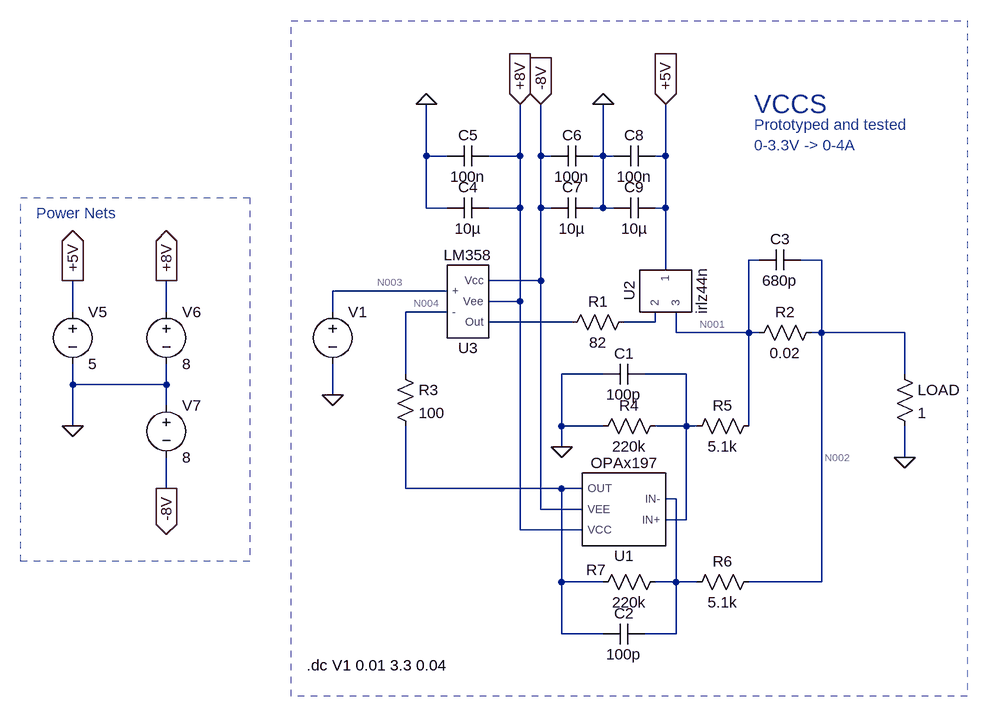
[diagram p0: schematic VCCS V2.asc]
VCCS V2.asc, the LTspice schematic file:
Version 4.1
SHEET 1 1476 900
WIRE 288 64 288 -16
WIRE 320 64 288 64
WIRE 432 64 432 -16
WIRE 432 64 384 64
WIRE 464 64 464 -16
WIRE 480 64 464 64
WIRE 560 64 560 -16
WIRE 560 64 544 64
WIRE 576 64 560 64
WIRE 656 64 656 -16
WIRE 656 64 640 64
WIRE 288 144 288 64
WIRE 320 144 288 144
WIRE 432 144 432 64
WIRE 432 144 384 144
WIRE 464 144 464 64
WIRE 480 144 464 144
WIRE 560 144 560 64
WIRE 560 144 544 144
WIRE 576 144 560 144
WIRE 656 144 656 64
WIRE 656 144 640 144
WIRE 800 224 784 224
WIRE 896 224 864 224
WIRE 656 240 656 144
WIRE 464 256 464 144
WIRE 464 256 384 256
WIRE 320 272 144 272
WIRE 432 288 432 144
WIRE 432 288 384 288
WIRE -256 304 -256 256
WIRE -112 304 -112 256
WIRE 144 304 144 272
WIRE 320 304 256 304
WIRE 512 320 384 320
WIRE 640 320 640 304
WIRE 640 320 592 320
WIRE 672 336 672 304
WIRE 784 336 784 224
WIRE 784 336 672 336
WIRE 800 336 784 336
WIRE 896 336 896 224
WIRE 896 336 880 336
WIRE 1024 336 896 336
WIRE 256 400 256 304
WIRE 560 400 496 400
WIRE 688 400 624 400
WIRE 1024 400 1024 336
WIRE -256 416 -256 384
WIRE -112 416 -112 384
WIRE -112 416 -256 416
WIRE 144 432 144 384
WIRE -112 448 -112 416
WIRE -256 480 -256 416
WIRE 496 480 496 400
WIRE 560 480 496 480
WIRE 688 480 688 400
WIRE 688 480 640 480
WIRE 704 480 688 480
WIRE 784 480 784 336
WIRE 496 512 496 480
WIRE 1024 528 1024 480
WIRE -112 576 -112 528
WIRE 256 576 256 480
WIRE 496 576 256 576
WIRE 528 576 496 576
WIRE 672 592 656 592
WIRE 464 608 464 256
WIRE 528 608 464 608
WIRE 688 624 688 480
WIRE 688 624 656 624
WIRE 432 640 432 288
WIRE 528 640 432 640
WIRE 496 720 496 576
WIRE 560 720 496 720
WIRE 672 720 672 592
WIRE 672 720 640 720
WIRE 704 720 672 720
WIRE 896 720 896 336
WIRE 896 720 784 720
WIRE 496 800 496 720
WIRE 560 800 496 800
WIRE 672 800 672 720
WIRE 672 800 624 800
FLAG 1024 528 0
FLAG 496 512 0
FLAG 144 432 0
FLAG -256 480 0
FLAG -256 256 +5V
IOPIN -256 256 Out
FLAG 656 -16 +5V
IOPIN 656 -16 In
FLAG -112 256 +8V
IOPIN -112 256 Out
FLAG -112 576 -8V
IOPIN -112 576 Out
FLAG 432 -16 +8V
IOPIN 432 -16 In
FLAG 464 -16 -8V
IOPIN 464 -16 In
FLAG 560 -16 0
FLAG 288 -16 0
SYMBOL res 896 320 R90
WINDOW 0 0 56 VBottom 2
WINDOW 3 32 56 VTop 2
SYMATTR InstName R2
SYMATTR Value 0.02
SYMBOL res 1008 384 R0
SYMATTR InstName LOAD
SYMATTR Value 1
SYMBOL res 656 464 R90
WINDOW 0 0 56 VBottom 2
WINDOW 3 32 56 VTop 2
SYMATTR InstName R4
SYMATTR Value 220k
SYMBOL res 800 464 R90
WINDOW 0 0 56 VBottom 2
WINDOW 3 32 56 VTop 2
SYMATTR InstName R5
SYMATTR Value 5.1k
SYMBOL res 800 704 R90
WINDOW 0 0 56 VBottom 2
WINDOW 3 32 56 VTop 2
SYMATTR InstName R6
SYMATTR Value 5.1k
SYMBOL res 656 704 R90
WINDOW 0 13 107 VBottom 2
WINDOW 3 32 56 VTop 2
SYMATTR InstName R7
SYMATTR Value 220k
SYMBOL voltage 144 288 R0
WINDOW 123 0 0 Left 0
WINDOW 39 0 0 Left 0
SYMATTR InstName V1
SYMATTR Value ""
SYMBOL voltage -256 288 R0
WINDOW 123 0 0 Left 0
WINDOW 39 0 0 Left 0
SYMATTR InstName V5
SYMATTR Value 5
SYMBOL voltage -112 288 R0
WINDOW 123 0 0 Left 0
WINDOW 39 0 0 Left 0
SYMATTR InstName V6
SYMATTR Value 8
SYMBOL voltage -112 432 R0
WINDOW 123 0 0 Left 0
WINDOW 39 0 0 Left 0
SYMATTR InstName V7
SYMATTR Value 8
SYMBOL irlz44n 656 272 M90
SYMATTR InstName U2
SYMBOL OPAx197 592 608 R180
SYMATTR InstName U1
SYMBOL res 608 304 R90
WINDOW 0 0 56 VBottom 2
WINDOW 3 32 56 VTop 2
SYMATTR InstName R1
SYMATTR Value 82
SYMBOL cap 624 384 R90
WINDOW 0 0 32 VBottom 2
WINDOW 3 32 32 VTop 2
SYMATTR InstName C1
SYMATTR Value 100p
SYMBOL cap 624 784 R90
WINDOW 0 0 32 VBottom 2
WINDOW 3 32 32 VTop 2
SYMATTR InstName C2
SYMATTR Value 100p
SYMBOL cap 864 208 R90
WINDOW 0 0 32 VBottom 2
WINDOW 3 32 32 VTop 2
SYMATTR InstName C3
SYMATTR Value 680p
SYMBOL cap 384 128 R90
WINDOW 0 0 32 VBottom 2
WINDOW 3 32 32 VTop 2
SYMATTR InstName C4
SYMATTR Value 10µ
SYMBOL cap 384 48 R90
WINDOW 0 0 32 VBottom 2
WINDOW 3 32 32 VTop 2
SYMATTR InstName C5
SYMATTR Value 100n
SYMBOL cap 544 48 R90
WINDOW 0 0 32 VBottom 2
WINDOW 3 32 32 VTop 2
SYMATTR InstName C6
SYMATTR Value 100n
SYMBOL cap 544 128 R90
WINDOW 0 0 32 VBottom 2
WINDOW 3 32 32 VTop 2
SYMATTR InstName C7
SYMATTR Value 10µ
SYMBOL cap 640 48 R90
WINDOW 0 0 32 VBottom 2
WINDOW 3 32 32 VTop 2
SYMATTR InstName C8
SYMATTR Value 100n
SYMBOL cap 640 128 R90
WINDOW 0 0 32 VBottom 2
WINDOW 3 32 32 VTop 2
SYMATTR InstName C9
SYMATTR Value 10µ
SYMBOL res 240 384 R0
SYMATTR InstName R3
SYMATTR Value 100
SYMBOL LM358 352 288 M180
SYMATTR InstName U3
TEXT 104 848 Left 2 !.dc V1 0.01 3.3 0.04
TEXT 792 -16 Left 4 ;VCCS
TEXT -312 152 Left 2 ;Power Nets
TEXT 792 16 Left 2 ;Prototyped and tested\n0-3.3V -> 0-4A
RECTANGLE Normal 16 688 -336 128 2
RECTANGLE Normal 1120 896 80 -144 2

The netlist it stands for:
* VCCS V2.asc
R2 N002 N001 0.02
R§LOAD N002 0 1
R4 N007 0 220k
R5 N001 N007 5.1k
R6 N002 N009 5.1k
R7 N009 N008 220k
V1 N003 0
V5 +5V 0 5
V6 +8V 0 8
V7 0 -8V 8
X§U2 +5V N006 N001 irlz44n  ; pins 1 2 3
X§U1 N007 N009 +8V -8V N008 OPAx197  ; pins IN+ IN- VCC VEE OUT
R1 N006 N005 82
C1 N007 0 100p
C2 N009 N008 100p
C3 N002 N001 680p
C4 +8V 0 10µ
C5 +8V 0 100n
C6 0 -8V 100n
C7 0 -8V 10µ
C8 +5V 0 100n
C9 +5V 0 10µ
R3 N004 N008 100
X§U3 N004 N003 N005 +8V -8V LM358  ; pins - + Out Vee Vcc
.dc V1 0.01 3.3 0.04
* VCCS
* Power Nets
* Prototyped and tested
* 0-3.3V -> 0-4A
.lib Y:\Projects\Programmable_Electronic_Load\LTSpice\Test Setups\VCCS V2\irlz44n.spi
.lib Z:\Projects\Programmable_Electronic_Load\LTSpice\Test Setups\VCCS\OPAx197.LIB
.lib Y:\Projects\Programmable_Electronic_Load\LTSpice\Test Setups\VCCS V2\lm358.txt
.backanno
.end

* Results of the author's LTspice run, read from the files saved beside the schematic
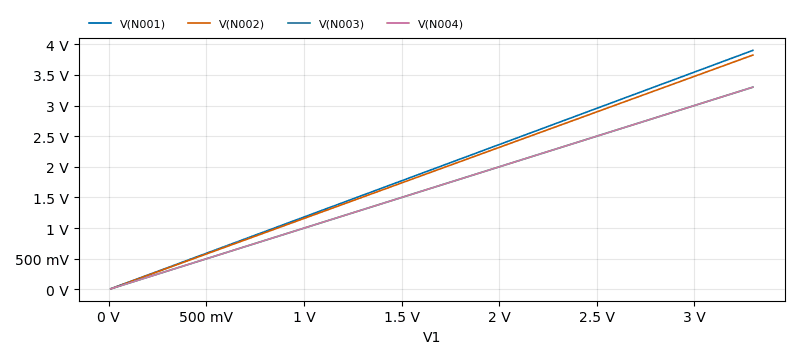
[diagram p1: DC transfer characteristic of VCCS V2.asc, plotted from the saved traces]
* DC transfer characteristic, 1 run:
*   V(N001): 10.72 mV at V1=10 mV, 3.9 V at V1=3.3 V, min 10.72 mV, max 3.9 V
*   V(N002): 10.51 mV at V1=10 mV, 3.824 V at V1=3.3 V, min 10.51 mV, max 3.824 V
*   V(N003): 10 mV at V1=10 mV, 3.3 V at V1=3.3 V, min 10 mV, max 3.3 V
*   V(N004): 9.979 mV at V1=10 mV, 3.3 V at V1=3.3 V, min 9.979 mV, max 3.3 V